# EAGLE design untitled (EAGLE 9.6.2)
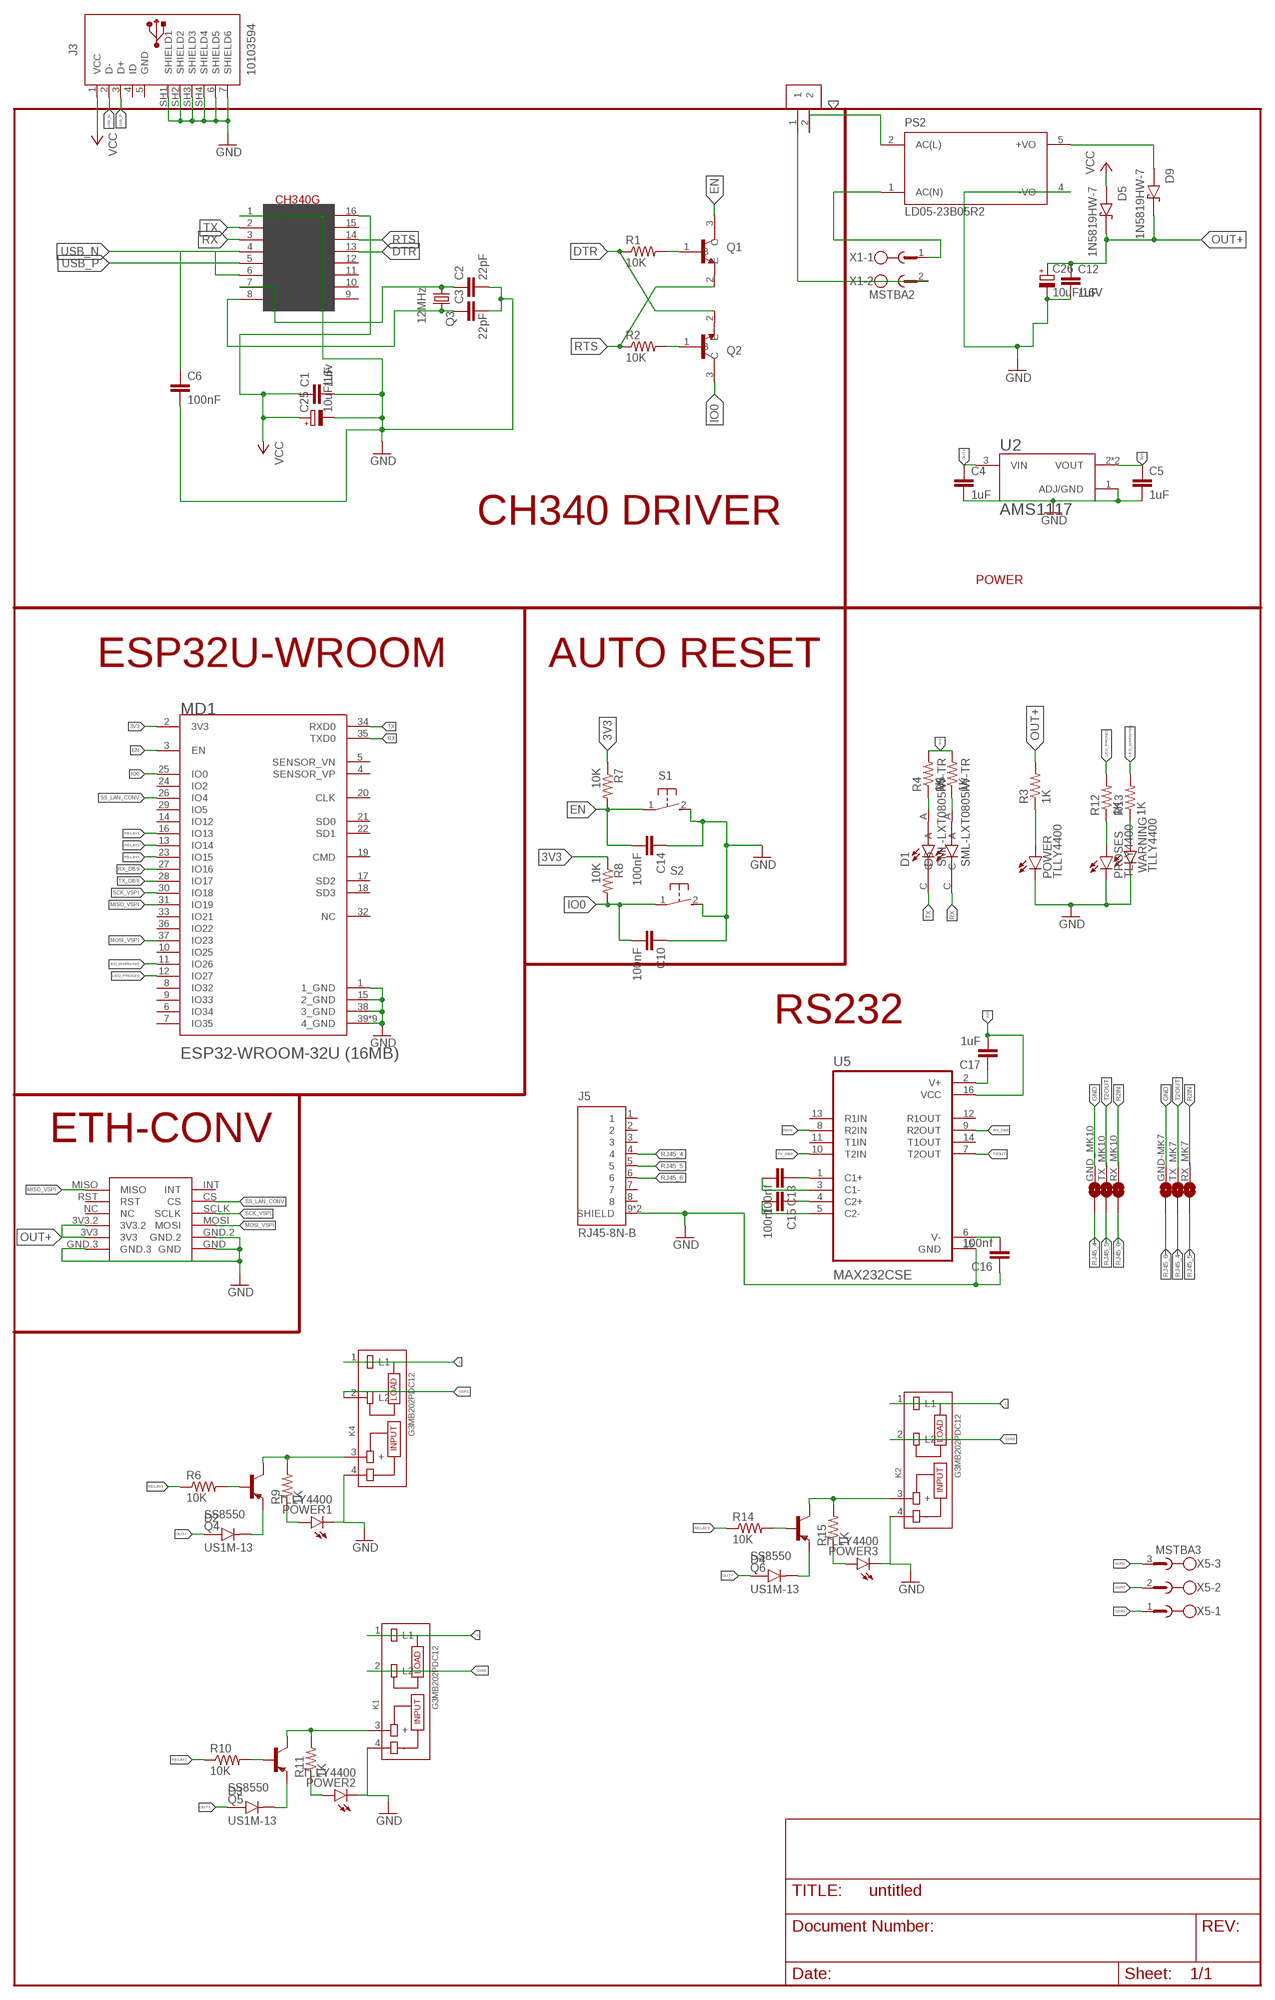
[diagram p0: schematic, sheet 1]

## Parts
C1  1uF  C-EUC0805K  [C0805K]
C2  22pF  C-EUC0805K  [C0805K]
C3  22pF  C-EUC0805K  [C0805K]
C4  1uF  C-EUC0805K  [C0805K]
C5  1uF  C-EUC0805K  [C0805K]
C6  100nF  C-EUC0805K  [C0805K]
C10  100nF  C-EUC0805K  [C0805K]
C12  1uF  C-EUC0805K  [C0805K]
C13  100nf  C-EUC0805  [C0805]
C14  100nF  C-EUC0805K  [C0805K]
C15  100nf  C-EUC0805  [C0805]
C16  100nf  C-EUC0805  [C0805]
C17  1uF  C-EUC0805  [C0805]
C25  10uF/16v  CPOL-EU153CLV-0505  [153CLV-0505]
C26  10uF/16V  CPOL-EU153CLV-0505  [153CLV-0505]
D1  SML-LXT0805IW-TR  [LEDC2012X120N]
D2  US1M-13  [DIOM5226X240N]
D3  US1M-13  [DIOM5226X240N]
D4  US1M-13  [DIOM5226X240N]
D5  1N5819HW-7  [SOD3715X145N]
D6  SML-LXT0805IW-TR  [LEDC2012X120N]
D9  1N5819HW-7  [SOD3715X145N]
FUSE-KOTAK1  FUSE-KOTAK  [FUSE-KOTAK]
GND-MK7  1X02-SJ-NO  [1X02-SJ-NO]
GND_MK10  1X02-SJ-NO  [1X02-SJ-NO]
J3  10103594  [10103594]
J5  RJ45-8N-B  [TE_RJ45-8N-B]
K1  G3MB202PDC12  [RELAY_G3MB202PDC12]
K2  G3MB202PDC12  [RELAY_G3MB202PDC12]
K4  G3MB202PDC12  [RELAY_G3MB202PDC12]
MD1  ESPRESSIF_SYSTEMS_ESP32-WROOM-32U_16MBESPRESSIF_SYSTEMS_ESP32-WROOM-32U_16MB_0_0  [ESPRESSIF_SYSTEMS_ESP32-WROOM-32U_16MB_0]
POWER  TLLY4400  [LED3MM]
POWER1  TLLY4400  [LED3MM]
POWER2  TLLY4400  [LED3MM]
POWER3  TLLY4400  [LED3MM]
PROSES  TLLY4400  [LED3MM]
PS2  LD05-23B05R2  [CONV_LD05-23B05R2]
Q1  MMBT3904  [SOT95P240X120-3N]
Q2  MMBT3904  [SOT95P240X120-3N]
Q3  12MHz  CRYSTALSM49  [SM49]
Q4  SS8550  [SOT-23_BEC]
Q5  SS8550  [SOT-23_BEC]
Q6  SS8550  [SOT-23_BEC]
R1  10K  R-US_M0805  [M0805]
R2  10K  R-US_M0805  [M0805]
R3  1K  R-US_M0805  [M0805]
R4  1K  R-US_M0805  [M0805]
R5  1K  R-US_M0805  [M0805]
R6  10K  R-US_M0805  [M0805]
R7  10K  R-US_M0805  [M0805]
R8  10K  R-US_M0805  [M0805]
R9  1K  R-US_M0805  [M0805]
R10  10K  R-US_M0805  [M0805]
R11  1K  R-US_M0805  [M0805]
R12  1K  R-US_M0805  [M0805]
R13  1K  R-US_M0805  [M0805]
R14  10K  R-US_M0805  [M0805]
R15  1K  R-US_M0805  [M0805]
RX_MK7  1X02-SJ-NO  [1X02-SJ-NO]
RX_MK10  1X02-SJ-NO  [1X02-SJ-NO]
S1  31-XX  [B3F-31XX]
S2  31-XX  [B3F-31XX]
TX_MK7  1X02-SJ-NO  [1X02-SJ-NO]
TX_MK10  1X02-SJ-NO  [1X02-SJ-NO]
U2  AMS1117  [SOT229P700X180-4N]
U5  MAX232CSE  [SOIC127P600X175-16N]
U$2  CH340G  [SOIC16]
U$3  MINI_W5500  [MINI_W5500]
WARNING  TLLY4400  [LED3MM]
X1  MSTBA2  [MSTBA2]
X5  MSTBA3  [MSTBA3]

## Nets
3V3: C5.1 C17.2 MD1.2(3V3) R4.2 R5.2 R7.1 R8.1 U2.2(VOUT) U2.4(VOUT) U5.16(VCC)
DTR: Q2.2(E) R1.1 U$2.13(DTR)
EN: C14.2 MD1.3(EN) Q1.3(C) R7.2 S1.1(P)
GND: C1.2 C2.2 C3.2 C4.2 C5.2 C6.2 C10.1 C12.2 C14.1 C16.1 C25.- C26.- GND-MK7.2 GND_MK10.2 J3.6(SHIELD5) J3.7(SHIELD6) J3.SH1(SHIELD1) J3.SH2(SHIELD2) J3.SH3(SHIELD3) J3.SH4(SHIELD4) J5.9(SHIELD) J5.10(SHIELD) K1.4(-) K2.4(-) K4.4(-) MD1.1(1_GND) MD1.15(2_GND) MD1.38(3_GND) MD1.39(4_GND) MD1.39-2(4_GND) MD1.39-3(4_GND) MD1.39-4(4_GND) MD1.39-5(4_GND) MD1.39-6(4_GND) MD1.39-7(4_GND) MD1.39-8(4_GND) MD1.39-9(4_GND) POWER1.K(C) POWER2.K(C) POWER3.K(C) POWER.K(C) PROSES.K(C) PS2.4(-VO) S1.2(S) S2.2(S) U2.1(ADJ/GND) U5.15(GND) U$2.1(GND) U$3.GND U$3.GND.2 U$3.GND.3 WARNING.K(C)
IO0: C10.2 MD1.25(IO0) Q2.3(C) R8.2 S2.1(P)
L: FUSE-KOTAK1.2 K1.1(L1) K2.1(L1) K4.1(L1) PS2.2(AC(L))
LED_PROSES: MD1.12(IO27) R12.2
LED_WARNING: MD1.11(IO26) R13.2
MISO_VSPI: MD1.31(IO19) U$3.MISO
MOSI_VSPI: MD1.37(IO23) U$3.MOSI
N$1: C2.1 Q3.1 U$2.7(XI)
N$2: C3.1 Q3.2 U$2.8(XO)
N$3: POWER.A R3.1
N$4: Q1.1(B) R1.2
N$5: Q2.1(B) R2.2
N$6: D2.C(K) Q4.E
N$7: Q4.B R6.2
N$8: D1.A R4.1
N$9: D6.A R5.1
N$10: C13.1 U5.1(C1+)
N$11: PS2.1(AC(N)) X1.1
N$12: C6.1 U$2.4(V3)
N$14: C13.2 U5.3(C1-)
N$15: K4.3(+) Q4.C R9.2
N$16: D9.A PS2.5(+VO)
N$17: FUSE-KOTAK1.1 X1.2
N$18: POWER1.A R9.1
N$19: C15.1 U5.4(C2+)
N$22: D3.C(K) Q5.E
N$23: Q5.B R10.2
N$24: C15.2 U5.5(C2-)
N$25: PROSES.A R12.1
N$26: C17.1 U5.2(V+)
N$27: C16.2 U5.6(V-)
N$28: R13.1 WARNING.A
N$29: K1.3(+) Q5.C R11.2
N$30: POWER2.A R11.1
N$33: D4.C(K) Q6.E
N$34: Q6.B R14.2
N$35: K2.3(+) Q6.C R15.2
N$36: POWER3.A R15.1
OUT+: C4.1 C12.1 C26.+ D2.A D3.A D4.A D5.C(K) D9.C(K) R3.2 U2.3(VIN) U$3.3V3 U$3.3V3.2
R2IN: RX_MK7.2 RX_MK10.2 U5.8(R2IN)
RELAY1: MD1.16(IO13) R6.1
RELAY2: MD1.13(IO14) R10.1
RELAY3: MD1.23(IO15) R14.1
RJ45_4: GND_MK10.1 J5.4 TX_MK7.1
RJ45_5: J5.5 RX_MK7.1 TX_MK10.1
RJ45_6: GND-MK7.1 J5.6 RX_MK10.1
RTS: Q1.2(E) R2.1 U$2.14(RTS)
RX: D6.C MD1.35(TXD0) U$2.3(RX)
RX_DB9: MD1.27(IO16) U5.9(R2OUT)
SCK_VSPI: MD1.30(IO18) U$3.SCLK
SS_LAN_CONV: MD1.26(IO4) U$3.CS
SSR1: K4.2(L2) X5.3
SSR2: K1.2(L2) X5.2
SSR3: K2.2(L2) X5.1
T2OUT: TX_MK7.2 TX_MK10.2 U5.7(T2OUT)
TX: D1.C MD1.34(RXD0) U$2.2(TX)
TX_DB9: MD1.28(IO17) U5.10(T2IN)
USB_N: J3.2(D-) U$2.6(D-)
USB_P: J3.3(D+) U$2.5(D+)
VCC: C1.1 C25.+ D5.A J3.1(VCC) U$2.16(VCC)
Unconnected: J3.4(ID) J5.1 J5.2 J5.3 J5.7 J5.8 MD1.4(SENSOR_VP) MD1.5(SENSOR_VN) MD1.6(IO34) MD1.7(IO35) MD1.8(IO32) MD1.9(IO33) MD1.10(IO25) MD1.14(IO12) MD1.17(SD2) MD1.18(SD3) MD1.19(CMD) MD1.20(CLK) MD1.21(SD0) MD1.22(SD1) MD1.24(IO2) MD1.29(IO5) MD1.32(NC) MD1.33(IO21) MD1.36(IO22) U5.11(T1IN) U5.12(R1OUT) U5.13(R1IN) U5.14(T1OUT) U$2.9(CTS) U$2.10(DSR) U$2.11(RI) U$2.12(DCD) U$2.15(RS232) U$3.INT U$3.NC U$3.RST

## Notes on the sheet
- CH340 DRIVER
- POWER
- ESP32U-WROOM | AUTO RESET
- RS232
- ETH-CONV

## Power pins joined to a net without a drawn wire
GND: J3.5(GND)

## Library data of the parts
C1-C6 C10 C12-C17 = rcl:C-EU: CAPACITOR, European symbol; SPICEPREFIX: C
C25 C26 = rcl:CPOL-EU: POLARIZED CAPACITOR, European symbol; SPICEPREFIX: C
D1 D6 = SML-LXT0805IW-TR:SML-LXT0805IW-TR: LED; Luminous Intensity:11µcd; Viewing Angle:140°; Forward Current:30mA; Forward Voltage:2V; Color:Red; LED Color:Red; Leaded Process Compatible:Yes; Lens Color:White; Mounting Type:Surface Mount ;RoHS Compliant: Yes Check availability <https://pricing.snapeda.com/parts/SML-LXT0805IW-TR/Lumex%20Opto/Components/view-part?ref=eda>; AVAILABILITY: In Stock; DESCRIPTION: Red - LED Indication - Discrete 2V 0805 (2012 Metric); MF: Lumex Opto/Components; MP: SML-LXT0805IW-TR; PACKAGE: 0805 Lumex; PRICE: None; PURCHASE-URL: https://pricing.snapeda.com/search/part/SML-LXT0805IW-TR/?ref=eda
D2-D4 = US1M-13:US1M-13: Diode, Fast Recovery, 1a, 1kv, Do-214ac-2, Full Reel Check availability <https://pricing.snapeda.com/parts/US1M-13/Diodes%20Incorporated/view-part?ref=eda>; AVAILABILITY: In Stock; DESCRIPTION: Diode Standard 1000 V 1A Surface Mount SMA; MF: Diodes Incorporated; MP: US1M-13; PACKAGE: DO-214AC-214 Diodes Incorporated; PRICE: None; PURCHASE-URL: https://pricing.snapeda.com/search/part/US1M-13/?ref=eda
D5 D9 = 1N5819HW-7:1N5819HW-7: 1N5819HW Series 40 V 1 A Surface Mount Schottky Barrier Rectifier - SOD-123 Check availability <https://pricing.snapeda.com/parts/1N5819HW-7/Diodes%20Inc./view-part?ref=eda>; AVAILABILITY: In Stock; DESCRIPTION: Diode Schottky 40 V 1A Surface Mount SOD-123; MF: Diodes Inc.; MP: 1N5819HW-7; PACKAGE: SOD-123 Fairchild Semiconductor; PRICE: None; PURCHASE-URL: https://pricing.snapeda.com/search/part/1N5819HW-7/?ref=eda
FUSE-KOTAK1 = FUSE-KOTAK:FUSE-KOTAK
GND-MK7 GND_MK10 RX_MK7 RX_MK10 TX_MK7 TX_MK10 = Ai_Connectors:1X02-SJ-NO: A.I. Device 1x02-SJ-* NC has a large amount of paste (see paste layer) so that it should jumper during reflow. Remember that we have a version with a buil-in trace, which needs to be cut in order to have the jumper be NO.
J3 = Connector_USB:10103594: USB(2.0) Micro-B, RCPT, 5POS, SMD-THT-R/A Datasheet <https://cdn.amphenol-icc.com/media/wysiwyg/files/documentation/datasheet/inputoutput/io_usb_micro.pdf> Drawing <https://cdn.amphenol-icc.com/media/wysiwyg/files/drawing/10103594.pdf>; CATEGORY: Connectors; CONTACTS: 5; CURRENT-RATING: 1.8A; DESCRIPTION: CONN RCPT USB2.0 MICRO B SMD R/A; GENDER: Receptacle; MANUFACTURER: Amphenol ICC (FCI); MOUNT_TYPE: R/A; MPN: 10103594-0001LF; OPERATING_TEMPERATURE: -30°C ~ 80°C; PART_STATUS: ACTIVE; ROHS_COMPLIANT: COMPLIANT; SUB_CATEGORY: USB; TYPE: USB-micro B; VOLTAGE-RATING: 100VAC
J5 = RJ45-8N-B:RJ45-8N-B: RJ Jack / Signal Line EMI/RFI Filters 6 TERM LOW PROFILE BLOCK INDUCTOR 8 PIN Check availability <https://pricing.snapeda.com/parts/RJ45-8N-B/TE%20Connectivity/view-part?ref=eda>; AVAILABILITY: In Stock; DESCRIPTION: Jack Modular Connector 8p8c (RJ45, Ethernet) 90° Angle (Right) Unshielded -; MF: TE Connectivity; MP: RJ45-8N-B; PACKAGE: None; PRICE: None; PURCHASE-URL: https://pricing.snapeda.com/search/part/RJ45-8N-B/?ref=eda
K1 K2 K4 = G3MB202PDC12:G3MB202PDC12: Relay 12vdc Isolation Photot Check availability <https://pricing.snapeda.com/parts/G3MB-202P-DC12/Omron%20Automation%20and%20Safety/view-part?ref=eda>; AVAILABILITY: In Stock; DESCRIPTION: Solid State Relays - PCB Mount 12VDC/100-240VAC 2A; MF: Omron Automation and Safety; MP: G3MB-202P-DC12; PACKAGE: SIP-4 Omron Automation; PRICE: None; PURCHASE-URL: https://pricing.snapeda.com/search/part/G3MB-202P-DC12/?ref=eda
MD1 = Espressif Systems - ESP32-WROOM-32U (16MB):ESPRESSIF_SYSTEMS_ESP32-WROOM-32U_16MB: Bluetooth, WiFi 802.11b/g/n, Bluetooth v4.2 +EDR, Class 1, 2 and 3 Transceiver Module 2.4GHz ~ 2.5GHz Antenna Not Included, U.FL Surface Mount; AUTOMOTIVE: No; BANDWIDTH: 72MHz; CENTROID_NOT_SPECIFIED: No; DATASHEET: https://www.espressif.com/sites/default/files/documentation/esp32-wroom-32d_esp32-wroom-32u_datasheet_en.pdf; DATA_RATE: 150Mbits/s; DEVICE_CLASS_L1: Integrated Circuits (ICs); DEVICE_CLASS_L2: RF Semiconductors and Devices; DEVICE_CLASS_L3: Transceivers; DIGIKEY_DESCRIPTION: RX TXRX MODULE WIFI U.FL SMD; DIGIKEY_PART_NUMBER: 1904-1028-1-ND; FOOTPRINT_VARIANT_NAME_0: Recommended_Land_Pattern; HEIGHT: 3.35mm; INTERFACE: I2C,SPI,UART,Ethernet,I2S,Other; LEAD_FREE: Yes; MAX_FREQUENCY: 2484MHz; MAX_SUPPLY_VOLTAGE: 3.6V; MF: Espressif Systems; MFG_PACKAGE_IDENT: 0; MFG_PACKAGE_IDENT_DATE: 0; MFG_PACKAGE_IDENT_REV: 0; MIN_SUPPLY_VOLTAGE: 3V; MOUSER_PART_NUMBER: 356-ES32WROOM32U16MB; MPN: ESP32-WROOM-32U (16MB); NOMINAL_SUPPLY_CURRENT: 0.5A; NUMBER_OF_ADC_CHANNELS: 16; NUMBER_OF_GPIO: 26; PACKAGE: BT_MODULE; PREFIX: MD; ROHS: Yes; SENSITIVITY: -98dBm; TEMPERATURE_RANGE_HIGH: +85°C; TEMPERATURE_RANGE_LOW: -40°C; VERIFICATION_VERSION: 0.0.0.3
POWER POWER1-POWER3 PROSES WARNING = led:TLLY4400: Low Current (2mA) LED 3 mm Tinted Diffused Package color YELLOW Source: Data sheet <http://www.farnell.com/datasheets/391098.pdf>; MF: VISHAY SEMICONDUCTOR; OC_FARNELL: 1612439
PS2 = LD05-23B05R2:LD05-23B05R2: AC/DC Converter Check availability <https://pricing.snapeda.com/parts/LD05-23B05R2/Mornsun%20America%2C%20LLC/view-part?ref=eda>; AVAILABILITY: In Stock; DESCRIPTION: Enclosed AC DC Converters 1 Uitgang 5V - - - 1A 85 ~ 305 VAC, 100 ~ 430 VDC Input; MF: Mornsun America, LLC; MP: LD05-23B05R2; PACKAGE: CUSTOM-4 MORNSUN; PRICE: None; PURCHASE-URL: https://pricing.snapeda.com/search/part/LD05-23B05R2/?ref=eda
Q1 Q2 = MMBT3904:MMBT3904: MMBT3904 Series 40 V CE Breakdown 0.2 A NPN General Purpose Amplifier - SOT-23 Check availability <https://pricing.snapeda.com/parts/MMBT3904/STMicroelectronics/view-part?ref=eda>; AVAILABILITY: Not in stock; DESCRIPTION: SMD Transistor MMBT3904 SOT-23 SMD DIOTEC; MF: STMicroelectronics; MP: MMBT3904; PACKAGE: SOT-23 ON; PRICE: None
Q3 = adafruit:CRYSTAL: CRYSTAL; OC_FARNELL: unknown; OC_NEWARK: unknown
Q4-Q6 = SS8550:SS8550: PNP de proposito general Vce=-40V, Ic-1.5A - 0.3W Check availability <https://pricing.snapeda.com/parts/SS8550/ON%20Semiconductor%20/%20Fairchild/view-part?ref=eda>; AVAILABILITY: In Stock; DESCRIPTION: Bipolar Transistors - BJT NPN/40V/1.5A; MF: ON Semiconductor / Fairchild; MP: SS8550; PACKAGE: SOT-23 ON Semiconductor / Fairchild; PRICE: None; PURCHASE-URL: https://pricing.snapeda.com/search/part/SS8550/?ref=eda
R1-R15 = adafruit:R-US_: RESISTOR, American symbol
S1 S2 = switch-omron:31-XX: OMRON SWITCH; MPN: B3F-3100; OC_FARNELL: 959704; OC_NEWARK: 36M3582
U2 = AMS1117:AMS1117: Sot223/Pkg 1-Amp 5-Volt Low Drop Out Voltage Regulatator Check availability <https://pricing.snapeda.com/parts/AMS1117/Advanced%20Monolithic%20Systems/view-part?ref=eda>; AVAILABILITY: Not in stock; DESCRIPTION: 1A LOW DROPOUT VOLTAGE REGULATOR SOT-223; MF: Advanced Monolithic Systems; MP: AMS1117; PACKAGE: SOT-223 Seeed Technology; PRICE: None
U5 = MAX232CSE:MAX232CSE: Check availability <https://pricing.snapeda.com/parts/MAX232CSE/Maxim%20Integrated/view-part?ref=eda>; AVAILABILITY: In Stock; DESCRIPTION: 2/2 Transceiver Full RS232 16-SOIC; MF: Maxim Integrated; MP: MAX232CSE; PACKAGE: SOIC-16 Maxim Integrated; PRICE: None; PURCHASE-URL: https://pricing.snapeda.com/search/part/MAX232CSE/?ref=eda
U$2 = usb-serial:CH340G
U$3 = ethernet-mikroavr:MINI_W5500: MINI ETHERNET W5500, CREATE BY MIKROAVR.COM
X1 = con-phoenix-508:MSTBA2: PHOENIX; MF: FARNELL; MPN: 1757242; OC_FARNELL: 3705171; OC_NEWARK: 71C4161
X5 = con-phoenix-508:MSTBA3: PHOENIX; MF: FARNELL; MPN: 1757255; OC_FARNELL: 3705183; OC_NEWARK: 71C4162

## Net classes
0 default: width 0.2 mm, clearance 0.15 mm

## Board
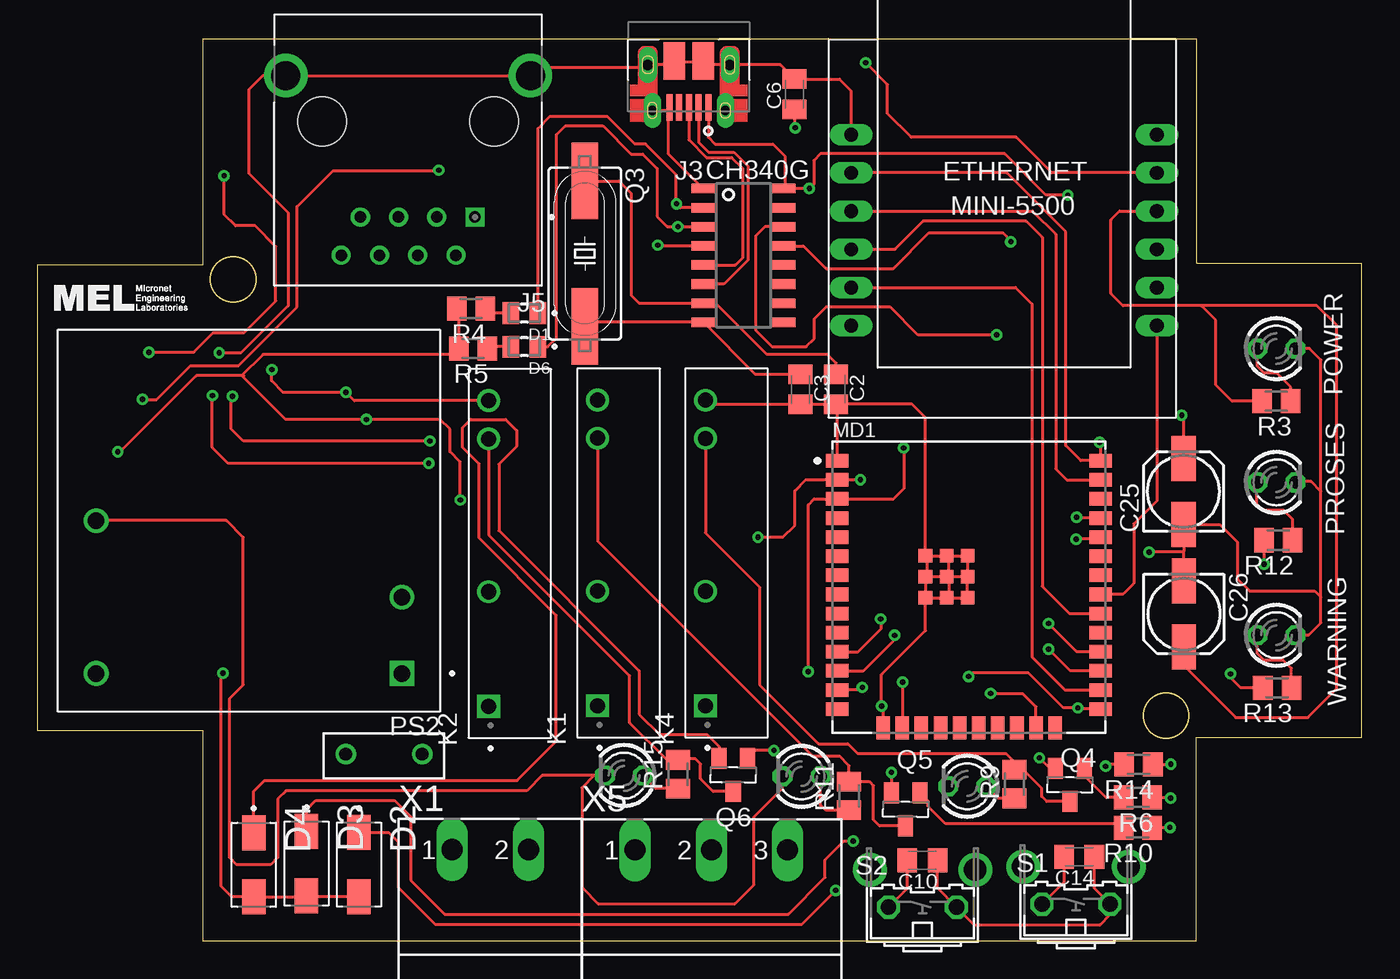
[diagram p1: board, top side]
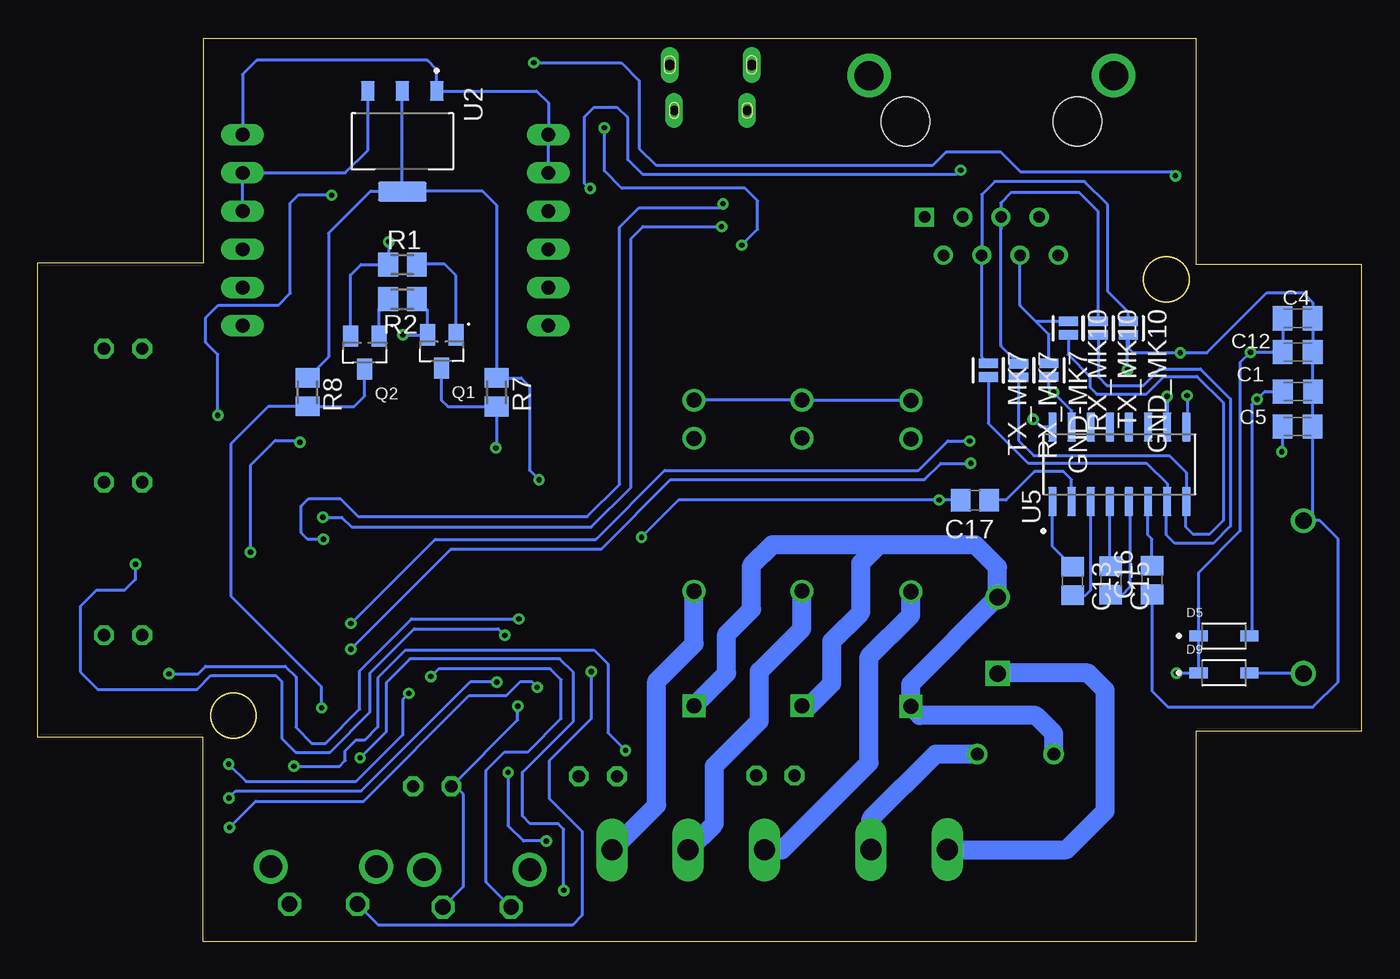
[diagram p2: board, bottom side, seen from below]

Size 88.01 x 60 mm. Coordinates in mm from the lower left corner, seen from the top.
Outline: 11,60 77,60 77,45.07 88.01,45.07 88.01,13.57 77,13.57 77,0 11,0 11,14 0,14 0,45 11,45 11,60
Outline: circle at 13,44 radius 1.5
Outline: circle at 75,15 radius 1.5
Copper layers (1*16): Top 0.035mm / dielectric 1.5mm / Bottom 0.035mm
Design rules "default": minimum track width 6mil, minimum drill 0.35mm, track to track 6mil, track to pad 6mil, pad to pad 6mil, via to via 6mil, smd to smd 6mil, copper to edge 40mil, drill to drill 6mil, minimum pad ring 10mil, minimum via ring 8mil, stop-mask expansion 4mil, vias tented up to drill 0mil, thermal gap 10mil

### Footprints (pad centres in the part's own frame; a part is rotated, then mirrored left to right if it is on the bottom)
C0805K = smd 1.3 x 1.6: 1 -1,0; 2 1,0
C0805 = smd 1.3 x 1.5: 1 -0.95,0; 2 0.95,0
153CLV-0505 = smd 3 x 1.6: + 2.2,0; - -2.2,0
LEDC2012X120N = smd 1.1 x 1.45: A 0.9,0; C -0.9,0
DIOM5226X240N = smd 2.33 x 1.55: A 2.135,0; C -2.135,0
SOD3715X145N = smd 1.21 x 0.73: A 1.68,0; C -1.68,0
FUSE-KOTAK = drill 0.85: 1 -5.54,-0.62; 2 -0.46,-0.62
1X02-SJ-NO = smd 0.635 x 1.27: 1 -0.45,0; 2 0.45,0
10103594 = smd 0.4 x 1.75: 1 -1.3,2.825; 2 -0.65,2.825; 3 0,2.825; 4 0.65,2.825; 5 1.3,2.825 | smd 1.425 x 2.5: 6 -0.963,-0.25; 7 0.963,-0.25 | drill 0.65 pad 0.73 long: SH1 -2.425,3.03; SH2 2.425,3.03 | drill 0.7 long: SH3 -2.725,0; SH4 2.725,0
TE_RJ45-8N-B = drill 0.76 square: 1 -4.445,6.35 | drill 0.76: 2 -3.175,8.89; 3 -1.905,6.35; 4 -0.635,8.89; 5 0.635,6.35; 6 1.905,8.89; 7 3.175,6.35; 8 4.445,8.89 | drill 1.93: 9 -8.125,-3.05; 10 8.125,-3.05 | hole 3.25: -5.715,0; 5.715,0
RELAY_G3MB202PDC12 = drill 1 square: 1 -10.16,1.4 | drill 1: 2 -2.54,1.4; 3 7.62,1.4; 4 10.16,1.4
ESPRESSIF_SYSTEMS_ESP32-WROOM-32U_16MB_0 = smd 1.5 x 0.9: 1 -8.75,8.41; 2 -8.75,7.14; 3 -8.75,5.87; 4 -8.75,4.6; 5 -8.75,3.33; 6 -8.75,2.06; 7 -8.75,0.79; 8 -8.75,-0.48; 9 -8.75,-1.75; 10 -8.75,-3.02; 11 -8.75,-4.29; 12 -8.75,-5.56; 13 -8.75,-6.83; 14 -8.75,-8.1; 25 8.75,-8.1; 26 8.75,-6.83; 27 8.75,-5.56; 28 8.75,-4.29; 29 8.75,-3.02; 30 8.75,-1.75; 31 8.75,-0.48; 32 8.75,0.79; 33 8.75,2.06; 34 8.75,3.33; 35 8.75,4.6; 36 8.75,5.87; 37 8.75,7.14; 38 8.75,8.41 | smd 0.9 x 1.5: 15 -5.71,-9.35; 16 -4.44,-9.35; 17 -3.17,-9.35; 18 -1.9,-9.35; 19 -0.63,-9.35; 20 0.64,-9.35; 21 1.91,-9.35; 22 3.18,-9.35; 23 4.45,-9.35; 24 5.72,-9.35 | smd 0.9 x 0.9: 39 -2.9,2.09; 39-2 -1.5,0.69; 39-3 -1.5,2.09; 39-4 -0.1,2.09; 39-5 -0.1,-0.71; 39-6 -1.5,-0.71; 39-7 -2.9,-0.71; 39-8 -0.1,0.69; 39-9 -2.9,0.69
LED3MM = drill 0.813 octagon: A -1.27,0; K 1.27,0
CONV_LD05-23B05R2 = drill 1.1 square: 1 -10.16,10.16 | drill 1.1: 2 -10.16,5.08; 4 10.16,0; 5 10.16,10.16
SOT95P240X120-3N = smd 1 x 1.4: 1 -0.95,-1.1; 2 0.95,-1.1; 3 0,1.1
SM49 = smd 5.08 x 1.778: 1 -4.826,0; 2 4.826,0
SOT-23_BEC = smd 1 x 1.4: B -0.95,-1.1; C 0,1.1; E 0.95,-1.1
M0805 = smd 1.3 x 1.6: 1 -0.95,0; 2 0.95,0
B3F-31XX = drill 1.016 octagon: 1 -2.261,-1.245; 2 2.261,-1.245 | drill 1.499 pad 2.159: 3 -3.505,1.245; 4 3.505,1.245
SOT229P700X180-4N = smd 1.31 x 0.93: 1 -3.345,2.29; 2 -3.345,0; 3 -3.345,-2.29 | smd 1.31 x 3.24: 4 3.345,0
SOIC127P600X175-16N = smd 1.97 x 0.59: 1 -2.475,4.445; 2 -2.475,3.175; 3 -2.475,1.905; 4 -2.475,0.635; 5 -2.475,-0.635; 6 -2.475,-1.905; 7 -2.475,-3.175; 8 -2.475,-4.445; 9 2.475,-4.445; 10 2.475,-3.175; 11 2.475,-1.905; 12 2.475,-0.635; 13 2.475,0.635; 14 2.475,1.905; 15 2.475,3.175; 16 2.475,4.445
SOIC16 = smd 0.635 x 1.524: 1 -4.445,-2.695; 2 -3.175,-2.695; 3 -1.905,-2.695; 4 -0.635,-2.695; 5 0.635,-2.695; 6 1.905,-2.695; 7 3.175,-2.695; 8 4.445,-2.695; 9 4.445,2.695; 10 3.175,2.695; 11 1.905,2.695; 12 0.635,2.695; 13 -0.635,2.695; 14 -1.905,2.695; 15 -3.175,2.695; 16 -4.445,2.695
MINI_W5500 = drill 0.914 long: 3V3 21.844,-8.89; 3V3.2 21.844,-11.43; CS 1.524,-16.51; GND 1.524,-6.35; GND.2 1.524,-8.89; GND.3 21.844,-6.35; INT 1.524,-19.05; MISO 21.844,-19.05; MOSI 1.524,-11.43; NC 21.844,-13.97; RST 21.844,-16.51; SCLK 1.524,-13.97
MSTBA2 = drill 1.397 long: 1 -2.54,5.08; 2 2.54,5.08
MSTBA3 = drill 1.397 long: 1 -5.08,5.08; 2 0,5.08; 3 5.08,5.08

### Placement (x,y rotation side)
C1  4.26,36.55 0 bottom
C2  53.06,36.7 270 top
C3  50.7,36.69 270 top
C4  4.27,41.41 0 bottom
C5  4.27,34.21 0 bottom
C6  50.31,56.31 90 top
C10  58.81,5.39 180 top
C12  4.26,39.16 0 bottom
C13  19.23,23.96 270 bottom
C14  69.23,5.63 180 top
C15  16.69,23.99 270 bottom
C16  13.95,24.01 90 bottom
C17  25.72,29.32 180 bottom
C25  76.16,29.9 90 top
C26  76.18,21.76 270 top
D1  32.35,41.76 180 top
D2  21.36,5.11 270 top
D3  17.87,5.17 270 top
D4  14.37,5.09 270 top
D5  9.17,20.3 0 bottom
D6  32.35,39.52 180 top
D9  9.17,17.85 0 bottom
FUSE-KOTAK1  20.02,11.82 180 top
GND-MK7  20.79,37.96 270 bottom
GND_MK10  15.53,40.76 270 bottom
J3  43.28,58.26 180 top
J5  24.62,54.5 180 top
K1  38.62,25.82 90 top
K2  31.38,25.78 90 top
K4  45.78,25.81 90 top
MD1  61.9,23.54 0 top
POWER  82.34,39.4 0 top
POWER1  61.78,10.31 180 top
POWER2  50.77,10.96 180 top
POWER3  38.98,11.02 180 top
PROSES  82.34,30.51 0 top
PS2  14.05,27.96 180 top
Q1  61.16,39.22 180 bottom
Q2  66.26,39.13 180 bottom
Q3  36.37,45.72 270 top
Q4  68.6,10.41 180 top
Q5  57.69,8.78 180 top
Q6  46.23,11.07 180 top
R1  63.77,44.99 0 bottom
R2  63.77,42.68 180 bottom
R3  82.33,35.91 180 top
R4  28.81,42.06 180 top
R5  28.94,39.41 180 top
R6  73.13,9.56 180 top
R7  57.5,36.5 270 bottom
R8  70.08,36.5 270 bottom
R9  64.92,10.46 90 top
R10  73.12,7.54 180 top
R11  53.93,9.67 90 top
R12  82.46,26.66 180 top
R13  82.38,16.85 180 top
R14  73.17,11.76 180 top
R15  42.55,11.11 90 top
RX_MK7  22.81,37.95 270 bottom
RX_MK10  19.52,40.76 270 bottom
S1  69.01,3.72 0 top
S2  58.81,3.52 0 top
TX_MK7  24.83,37.96 270 bottom
TX_MK10  17.53,40.75 270 bottom
U2  63.77,53.18 270 bottom
U5  16.12,31.71 90 bottom
U$2  46.91,45.59 270 top
U$3  52.54,59.97 0 top
WARNING  82.34,20.35 0 top
X1  30.07,1.02 0 top
X5  44.77,1 0 top

### Tracks (layer width: path | path; a pad name or v marks a point on that pad's centre or on a via)
3V3  (via drill 0.35)
  Top 0.203: R4.2 27.99,41.92 R5.2 27.6,39.01 14.99,39.01 13.57,37.6 16.48,34.69 v21.86,34.69 26.76,34.69 27.41,34.05 27.41,32.56 28.09,31.88 v28.09,29.34 | v54.69,30.69 v54.68,30.68 MD1.2 51.06,30.69 50.32,29.94 50.32,27.66 49.53,26.87 v47.88,26.87 | 13.71,37.6 10.55,37.6 5.5,32.55 v5.32,32.55
  Bottom 0.203: U2.4 63.54,49.61 63.23,49.61 62.98,49.85 58.43,49.85 57.5,48.92 R7.1 55.88,37.45 55.32,36.89 55.32,31.32 v54.69,30.69 | R8.1 68.68,38.85 68.68,47.06 65.87,49.87 63.81,49.87 U2.4 | U2.4 U2.2 | U5.16 21.35,34.19 v21.86,34.69 | v5.32,32.55 5.27,32.6 C5.1 | C17.2 26.69,29.34 v28.09,29.34 45.41,29.34 v47.88,26.87
DTR  (via drill 0.35)
  Top 0.203: U$2.13 50.89,46.23 52.4,44.73 56.87,44.73 59.25,47.11 64.16,47.11 64.72,46.55 v64.68,46.51
  Bottom 0.203: Q2.2 67.22,44.29 66.52,44.99 64.76,44.99 | 64.76,44.99 R1.1 | v64.68,46.51 64.68,45.07 64.76,44.99
EN  (via drill 0.35)
  Top 0.203: S1.1 68.23,3.96 C14.2 | v57.56,32.8 57.56,30.09 56.89,29.41 MD1.3 51.61,29.41 51.22,29.01 v51.22,17.93
  Bottom 0.203: Q1.3 61.16,35.96 60.74,35.55 R7.2 57.5,32.86 v57.56,32.8 | S1.1 65.39,1.12 52.44,1.12 51.81,1.75 51.81,7.29 54,9.48 54,12.02 51.24,14.78 51.24,17.93 v51.22,17.93
GND  (via drill 0.35)
  Top 0.203: J3.5 41.94,55.39 | 41.94,55.39 41.78,55.23 J3.SH2 40.56,55.53 40.56,58.12 | 40.56,58.12 J3.SH4 42.07,58.26 42.25,58.44 | J3.7 42.25,58.44 | J3.6 44.2,58.47 | 44.2,58.47 44.18,58.44 42.25,58.44 | 45.91,58.26 J3.SH3 49.36,58.26 C6.2 53.29,57.31 54.07,56.54 U$3.GND | 45.91,58.26 44.4,58.26 44.2,58.47 | J3.SH1 45.91,55.43 45.91,58.26 | 40.56,58.12 33.32,58.12 J5.9 J5.10 14.96,57.55 14.03,56.62 14.03,51.05 16.66,48.42 16.66,42.25 13.53,39.12 v12.06,39.12 | 59.15,25.63 MD1.39 59,34.81 58.12,35.7 C2.2 | 59.15,25.63 MD1.39-3 60.56,25.63 | 60.56,25.63 MD1.39-4 MD1.39-8 61.65,24.23 | 61.65,24.23 60.59,24.23 | 60.59,24.23 MD1.39-2 | MD1.39-2 MD1.39-9 | MD1.39-9 59.15,24.37 59.15,25.63 | MD1.39-9 MD1.39-7 | MD1.39-7 MD1.39-6 | MD1.39-6 MD1.39-5 61.8,24.07 61.65,24.23 | MD1.39-6 60.59,23.01 60.59,24.23 | MD1.39-2 60.56,24.38 60.56,25.63 | U$2.1 41.94,52.32 41.94,55.39 | C10.1 59.81,3.54 S2.2 62.23,1.12 70.62,1.12 71.27,1.78 S1.2 70.23,3.51 C14.1 | C26.- 76.17,23.97 76.17,25.9 | 76.17,25.9 C25.- 78.57,27.7 79.74,26.54 79.74,24.1 80.55,23.29 84.87,23.29 85.29,22.88 | WARNING.K 84.47,20.35 85.29,21.17 85.29,22.88 | 85.29,22.88 85.29,29.92 | 85.29,29.92 84.65,30.56 83.65,30.56 PROSES.K | 85.29,29.92 85.29,38.64 84.53,39.4 POWER.K | C3.2 50.71,35.7 | 50.71,35.7 C2.2 | MD1.1 53.15,35.61 C2.2 | K4.4 44.66,35.7 50.71,35.7 | MD1.15 56.19,15.53 v56.09,15.63 56.09,17.73 59.02,20.65 59.02,22.82 MD1.39-7 | MD1.38 70.62,31.95 | 70.62,31.95 69.33,31.95 68.33,32.95 68.33,47.17 64.41,51.08 U$3.GND.2 | K2.4 21.05,35.94 v20.49,36.5 | v20.49,36.5 20.48,36.51 | v20.49,36.5 16.32,36.5 15.54,37.28 15.54,37.97 v15.57,38 | 76.17,25.9 76.13,25.87 v73.87,25.87
  Top 0.203: v70.59,33.18 70.62,33.14 70.62,31.95 | POWER2.K 49.5,10.17 47.6,8.26 47.6,3.76 46.34,2.5 37.25,2.5 36.18,3.58 36.18,10.21 36.99,11.02 POWER3.K 33.53,11.02 32.53,10.02 16.51,10.02 15.95,9.46 15.95,5.58 15.48,5.1 13.23,5.1 12.75,5.58 12.75,16.14 13.66,17.05 13.66,26.86 12.56,27.96 PS2.4
  Bottom 0.203: U$3.GND.3 74.39,57.63 73.45,58.56 62.1,58.56 61.48,57.94 U2.1 54.86,56.53 54.07,55.73 U$3.GND U$3.GND.2 | U5.15 19.29,35.3 v20.49,36.5 20.81,36.81 20.81,37.5 GND-MK7.2 | K2.4 37.17,35.94 K1.4 44.37,35.98 K4.4 | C16.1 13.96,16.64 12.88,15.57 3.25,15.57 1.58,17.25 1.58,26.75 2.79,27.96 PS2.4 3.52,27.96 3.27,28.21 C5.2 3.27,36.54 C1.2 3.26,39.15 C12.2 C4.2 3.27,42.44 3.94,43.12 6.3,43.12 10.3,39.12 v12.06,39.12 15.22,39.12 15.53,39.43 GND_MK10.2 15.57,40.26 v15.57,38 | v56.09,15.63 56.11,15.63 56.11,14.71 POWER1.K 60.24,10.31 59.71,9.77 59.71,3.64 S2.2 | v73.87,25.87 73.87,31.65 72.21,33.3 70.69,33.3 70.59,33.21 v70.59,33.18
IO0  (via drill 0.35)
  Top 0.203: S2.1 57.81,3.53 C10.2 | 70.6,15.38 MD1.25 69.22,15.44 v69.14,15.52 68.18,15.52 65.84,17.86 62.13,17.86 v61.88,17.61 | v61.88,17.61
  Bottom 0.203: Q2.3 66.27,36.26 66.97,35.55 R8.2 72.69,35.55 75.18,33.07 75.18,22.97 69.14,16.93 v69.14,15.52 | S2.1 58.2,3.93 58.2,11.36 56.97,12.59 55.42,12.59 53.21,14.81 53.21,17.39 53.94,18.12 61.36,18.12 v61.88,17.61
L
  Bottom 1.27: FUSE-KOTAK1.2 20.48,13.82 21.68,15.02 29.37,15.02 K2.1 29.98,17.11 PS2.2 24.21,24.88 25.71,26.38 31.5,26.38 32.08,26.38 | K1.1 36.7,15.66 35.22,17.15 35.22,19.96 33.3,21.87 33.3,25.15 32.08,26.38 | K4.1 42.22,17.82 42.22,20.41 40.55,22.07 40.55,25.01 39.19,26.38 32.08,26.38
LED_PROSES  (via drill 0.35)
  Top 0.203: R12.2 v81.51,25.08 v81.51,25.07 | v56.97,20.34 56.97,20.06 54.89,17.98 MD1.12
  Bottom 0.203: v81.51,25.07 81.51,24.06 82.24,23.33 84.12,23.33 85.18,22.26 85.18,17.91 84.02,16.75 77.41,16.75 76.5,17.67 72.19,17.67 71.79,17.27 71.79,13.5 70.85,12.57 68.59,12.57 65.92,15.24 65.92,17.83 62.98,20.77 57.4,20.77 v56.97,20.34
LED_WARNING  (via drill 0.35)
  Top 0.203: R13.2 79.96,16.85 79.29,17.53 v79.29,17.78 | MD1.11 54.53,19.25 56.04,20.76 v56.04,21.44
  Bottom 0.203: v79.29,17.78 77.35,17.78 76.85,18.28 71.56,18.28 70.84,17.57 70.84,14.22 69.79,13.18 68.88,13.18 66.61,15.44 66.61,17.98 63.16,21.44 v56.04,21.44
MISO_VSPI
  Top 0.203: MD1.31 72.12,23.06 72.85,23.8 72.85,27.75 74.39,29.28 U$3.MISO
MOSI_VSPI
  Top 0.203: U$3.MOSI 66.13,48.54 67.66,47.01 67.66,31.4 68.4,30.67 70.66,30.67 MD1.37
N$1
  Top 0.203: Q3.1 38.63,50.54 39.45,49.72 39.45,42.95 39.98,42.42 U$2.7 44.24,42.44 45.04,42.44 48.47,39.01 52.5,39.01 53.06,38.45 C2.1
N$2
  Top 0.203: Q3.2 36.63,41.15 U$2.8 44.25,41.15 47.71,37.69 C3.1
N$3
  Top 0.203: R3.1 83.28,36.84 82.36,37.76 81.54,37.76 81.07,38.23 POWER.A
N$4
  Bottom 0.203: Q1.1 60.21,44.25 60.96,45 62.8,45 R1.2
N$5
  Bottom 0.203: Q2.1 65.32,42.08 R2.2
N$6  (via drill 0.35)
  Top 0.203: D2.C 23.33,7.24 23.96,6.61 23.96,3.6 26.43,1.13 50.79,1.13 v53.04,3.39 | Q4.E 67.28,11.51 66.59,12.19 v66.58,12.19
  Bottom 0.203: v53.04,3.39 53.04,7.46 53.41,7.83 55.28,7.83 55.79,8.34 55.79,11.24 52.41,14.62 52.41,17.87 53.31,18.78 63.27,18.78 64.85,17.19 64.85,13.92 v66.58,12.19
N$7
  Top 0.203: R6.2 71,9.56 69.55,11.01 Q4.B
N$8
  Top 0.203: D1.A 30.05,41.76 R4.1
N$9
  Top 0.203: R5.1 30.01,39.52 D6.A
N$10
  Bottom 0.203: C13.1 20.56,26.24 U5.1
N$11
  Bottom 1.27: X1.1 19.63,6.1 17.06,8.67 17.06,16.69 18.21,17.83 24.18,17.83 PS2.1
N$12  (via drill 0.35)
  Top 0.203: U$2.4 41.27,46.23 v41.22,46.28 | v50.35,54.08 50.35,55.28 C6.1
  Bottom 0.203: v41.22,46.28 40.16,47.34 40.16,49.23 40.99,50.06 49.19,50.06 50.35,51.22 v50.35,54.08
N$14
  Bottom 0.203: C13.2 18.38,23.01 18.01,23.37 18.01,29.23 U5.3
N$15
  Top 0.203: Q4.C 67.06,9.31 66.74,9.63 66.74,10.17 65.5,11.41 R9.2 64.92,11.92 64.35,12.49 54.5,12.49 53.85,13.14 51.9,13.14 47.99,17.05 47.99,23.54 44.38,27.15 K4.3
N$16
  Bottom 0.203: D9.A 3.94,17.85 PS2.5
N$17
  Bottom 1.27: X1.2 32.61,8.17 28.32,12.46 25.58,12.46 FUSE-KOTAK1.1
N$18
  Top 0.203: R9.1 63.85,9.51 POWER1.A
N$19
  Bottom 0.203: C15.1 16.75,25 U5.4
N$22  (via drill 0.35)
  Top 0.203: D3.C 17.87,8.75 18.49,9.37 23.72,9.37 24.8,8.3 24.8,4.07 27.06,1.81 49.89,1.81 52.33,4.25 52.33,5.41 53.6,6.67 v54.2,6.67 | Q5.E 56.75,9.89 v56.75,11.23
  Bottom 0.203: v56.75,11.23 56.75,7.7 55.73,6.67 v54.2,6.67
N$23
  Top 0.203: Q5.B 59.18,9.34 59.18,8.98 60.34,7.83 71.88,7.83 R10.2
N$24
  Bottom 0.203: C15.2 15.92,23.04 15.38,23.58 15.38,29.14 U5.5
N$25
  Top 0.203: R12.1 83.41,28.05 82.81,28.65 81.46,28.65 81.04,29.06 81.04,30.49 PROSES.A
N$26
  Bottom 0.203: U5.2 19.29,30.69 19.83,31.22 21.76,31.22 23.66,29.32 C17.1
N$27
  Bottom 0.203: C16.2 13.96,26.75 14.21,27 U5.6
N$28
  Top 0.203: R13.1 83.33,18.14 82.81,18.66 81.54,18.66 81.07,19.14 WARNING.A
N$29
  Top 0.203: K1.3 37.22,26.61 51.51,12.32 53.3,12.32 53.94,11.68 R11.2 55.28,10.62 55.56,10.34 55.56,8.07 55.95,7.68 Q5.C
N$30
  Top 0.203: R11.1 52.38,8.72 52.03,9.07 52.03,10.94 POWER2.A
N$33
  Top 0.203: D4.C 14.37,9.98 15.09,10.7 31.88,10.7 34.47,13.29 34.47,21.68 29.34,26.8 29.34,31.73 28.25,32.83 28.25,34.17 28.78,34.7 31.1,34.7 31.84,33.96 31.84,32.91 30.65,31.72 30.65,27.31 39.97,17.99 39.97,15.09 41.32,13.74 44.5,13.74 45.28,12.96 Q6.E
N$34  (via drill 0.35)
  Top 0.203: R14.2 71.1,11.76 v70.97,11.64 | v48.94,12.69 47.7,12.69 Q6.B
  Bottom 0.203: v48.94,12.69 50.11,13.86 50.11,18.43 51.04,19.36 63.56,19.36 65.41,17.5 65.41,14.24 66.29,13.37 66.87,13.37 67.57,12.67 67.57,12.02 67.95,11.64 v70.97,11.64
N$35
  Top 0.203: Q6.C 44.9,9.97 44.06,10.81 44.06,11.79 43.73,12.12 42.6,12.12 R15.2 41.82,12.06 39.35,14.54 39.35,17.65 29.98,27.02 K2.3
N$36
  Top 0.203: R15.1 41.1,10.16 POWER3.A
OUT+  (via drill 0.35)
  Top 0.203: R3.2 79.38,35.9 78.3,36.99 78.3,41.29 77.33,42.26 | 77.33,42.26 72.13,42.26 71.33,43.06 71.33,47.97 71.91,48.54 U$3.3V3.2 | D2.A 17.93,2.97 D3.A 17.78,2.95 D4.A 12.9,2.95 12.18,3.68 12.18,17.7 v12.31,17.83 | C26.+ 76.18,18.33 79.62,14.88 84.42,14.88 86.34,16.8 86.34,40.95 85.03,42.26 77.33,42.26 | v7.4,39.16 10.38,39.16 11.67,40.45 13.72,40.45 15.83,42.56 15.83,46.19 14.47,47.56 13.15,47.56 12.39,48.32 v12.39,50.89 | U$3.3V3 67.4,51.08 65.05,53.44 58.06,53.44 56.5,55 56.5,56.95 v55.04,58.4
  Bottom 0.203: U2.3 66.06,52.59 67.57,51.08 U$3.3V3 U$3.3V3.2 | C4.1 C12.1 v7.4,39.16 8.07,38.49 8.07,27.3 10.85,24.52 D5.C D9.C 10.87,17.83 v12.31,17.83 | v55.04,58.4 49.21,58.4 48.03,57.22 48.03,52.7 46.91,51.59 28.52,51.59 27.63,52.48 24.02,52.48 22.7,51.16 12.63,51.16 12.37,50.91 v12.39,50.89
R2IN
  Bottom 0.203: RX_MK7.2 22.81,33.3 21.8,32.29 12.79,32.29 11.67,31.17 U5.8 11.69,29.22 11.69,27.54 11.21,27.05 10.15,27.05 9.22,27.98 9.22,35.81 10.96,37.54 13.16,37.54 14.33,36.37 17.61,36.37 18.07,36.83 18.07,37.54 19.52,38.99 RX_MK10.2
RELAY1  (via drill 0.35)
  Top 0.203: R6.1 75.27,9.56 v75.31,9.53 | v57.49,17.23 57.49,14.21 MD1.16
  Bottom 0.203: v57.49,17.23 59.27,17.23 66.5,10 74.84,10 v75.31,9.53
RELAY2  (via drill 0.35)
  Top 0.203: v75.25,7.58 75.22,7.54 R10.1 | v54.81,16.88 54.64,16.71 MD1.13
  Bottom 0.203: v75.25,7.58 73.51,9.32 66.35,9.32 59.32,16.35 56.85,16.35 55.93,17.27 55.2,17.27 v54.81,16.88
RELAY3  (via drill 0.35)
  Top 0.203: R14.1 75.3,11.76 v75.32,11.78 | MD1.23 66.35,15.59 65.46,16.48 v63.34,16.48
  Bottom 0.203: v75.32,11.78 74.16,10.62 66.85,10.62 63.75,13.72 63.75,16.07 v63.34,16.48
RJ45_4
  Bottom 0.203: TX_MK7.1 25.26,38.84 25.26,45.55 J5.4 25.26,49.65 24.41,50.5 18.43,50.5 16.89,48.96 16.89,43.21 15.53,41.84 GND_MK10.1
RJ45_5
  Bottom 0.203: RX_MK7.1 23.99,39.58 23.99,47.37 | 23.99,47.37 J5.5 | TX_MK10.1 17.53,48.52 18.78,49.77 23.32,49.77 24.01,49.08 24.01,47.39 23.99,47.37
RJ45_6
  Bottom 0.203: RX_MK10.1 21.67,41.21 | J5.6 22.72,42.26 21.67,41.21 | GND-MK7.1 20.79,40.34 21.67,41.21
RTS  (via drill 0.35)
  Top 0.203: U$2.14 48.33,47.5 47.71,46.88 47.71,40.63 48.82,39.52 51.07,39.52 51.62,40.07 51.62,41.38 52.42,42.18 56.63,42.18 58.47,40.35 58.51,40.31 | 58.51,40.31 58.52,40.3 | v63.74,40.31 58.51,40.31
  Bottom 0.203: R2.1 62.11,41.97 Q1.2 v63.74,40.31
RX  (via drill 0.35)
  Top 0.203: MD1.35 69.13,28.14 69.08,28.19 v69.05,28.19 | U$2.3 44.21,47.51 v42.56,47.51 41.84,47.51 41.17,48.18 41.17,51.38 40.22,52.33 39.45,52.33 37.57,54.21 35.08,54.21 34.49,53.62 34.49,40.11 33.9,39.52 D6.C
  Bottom 0.203: v69.05,28.19 67.79,28.19 67.14,27.53 51.22,27.53 48.59,30.17 48.59,46.7 47.78,47.51 v42.56,47.51
RX_DB9  (via drill 0.35)
  Top 0.203: MD1.27 68.63,17.98 v67.2,19.41 | v25.99,31.77 12.67,31.77 11.61,32.83 v11.61,36.28
  Bottom 0.203: v67.2,19.41 60.54,26.08 50.55,26.08 45.94,30.69 29.07,30.69 27.99,31.77 v25.99,31.77 | v11.61,36.28 11.61,34.25 U5.9
SCK_VSPI
  Top 0.203: U$3.SCLK 56.98,46 58.85,47.87 65.7,47.87 66.77,46.8 66.77,23.6 68.58,21.79 MD1.30
SS_LAN_CONV
  Top 0.203: U$3.CS 64.99,43.46 66.09,42.36 66.09,18.9 68.28,16.71 MD1.26
SSR1
  Bottom 1.27: X5.3 46.88,9.05 46.88,17.29 44.38,19.79 K4.2
SSR2
  Bottom 1.27: X5.2 43.04,7.81 43.04,11.66 40.05,14.65 40.05,17.95 37.22,20.78 K1.2
SSR3
  Bottom 1.27: X5.1 38.55,6.08 32.75,11.88 32.75,18.93 29.98,21.7 K2.2
T2OUT
  Bottom 0.203: TX_MK7.2 24.83,34.43 22.19,31.79 14.31,31.79 12.94,30.42 U5.7 12.99,29.19 12.99,27.03 12.42,26.46 9.88,26.46 8.73,27.61 8.73,36.05 10.74,38.05 13.44,38.05 14.54,36.95 16.94,36.95 17.53,37.54 17.53,38.7 TX_MK10.2
TX  (via drill 0.35)
  Top 0.203: D1.C 33.25,54.03 34.03,54.82 37.87,54.82 39.7,52.99 40.41,52.99 42.44,50.96 42.44,49.05 v42.46,49.03 42.72,48.77 U$2.2 | MD1.34 70.52,26.73 v69.03,26.73
  Bottom 0.203: v69.03,26.73 70.06,26.73 70.49,27.15 70.49,28.93 69.98,29.44 67.91,29.44 66.7,28.23 51.48,28.23 49.34,30.37 49.34,47.47 48.04,48.77 42.93,48.77 | 42.93,48.77 42.72,48.77 v42.46,49.03 | 42.93,48.77
TX_DB9  (via drill 0.35)
  Top 0.203: MD1.28 69.07,19.25 v67.19,21.13 | v26.07,33.26 13.67,33.26 12.86,34.06 12.86,36.14 v12.94,36.22
  Bottom 0.203: v67.19,21.13 61.59,26.73 50.91,26.73 46.33,31.31 29.48,31.31 27.53,33.26 v26.07,33.26 | v12.94,36.22 U5.10
USB_N
  Top 0.2: J3.2 43.93,53.12 44.6,52.45 46.28,52.45 47.2,51.53 47.2,45.28 45.61,43.69 U$2.6
USB_P
  Top 0.2: J3.3 43.28,53.27 44.46,52.1 46.13,52.1 46.85,51.38 46.85,45.43 46.38,44.96 U$2.5
VCC  (via drill 0.35)
  Top 0.203: J3.1 44.58,53.44 45.02,53 48.87,53 49.67,52.2 49.67,50.1 U$2.16 49.62,50.05 v51.29,50.05 51.59,50.34 51.59,51.9 52.03,52.34 64.28,52.34 67.02,49.6 v68.47,49.6 | v6.97,36.03 7.93,36.03 10.17,38.27 13.35,38.27 17.25,42.16 17.25,48.84 19.63,51.22 26.62,51.22 v26.66,51.26 | C25.+ 76.17,34.83 v76.04,34.96
  Bottom 0.203: D5.A 7.32,20.47 7.32,35.68 v6.97,36.03 6.44,36.56 C1.1 | v26.66,51.26 26.96,50.96 47.79,50.96 48.78,51.96 48.78,54.73 49.46,55.41 51.07,55.41 51.69,54.79 51.69,50.4 51.33,50.04 v51.3,50.04 v51.29,50.05 | v76.04,34.96 76.04,39.02 76.83,39.81 76.83,41.46 76.01,42.28 72.01,42.28 71.21,43.08 71.21,49.08 70.67,49.63 68.47,49.63 v68.47,49.6